# Altium schematic sheet TColourBar.SchDoc: LiveDesign Evaluation - EvalBoard Tester
size A4; Organization: Altium Limited; Address1: L3, 12a Rodborough Rd; Address2: Frenchs Forest; Address3: NSW; Address4: Australia 2086; DocumentNumber: 11; SheetNumber: 11; SheetTotal: 16
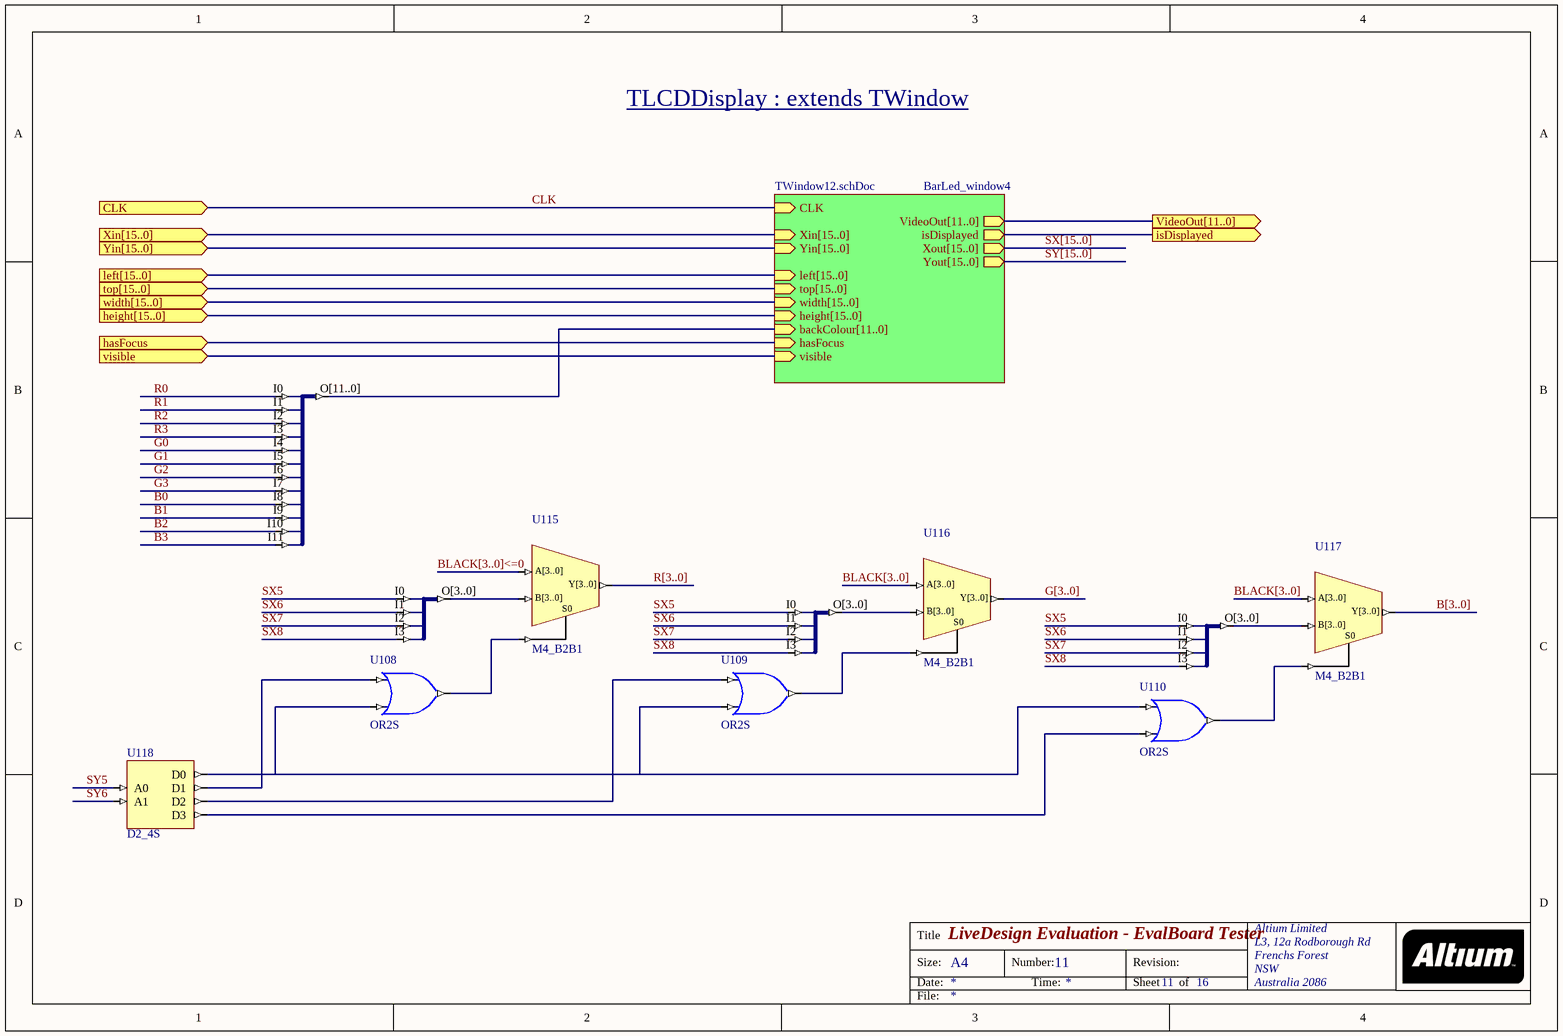
[diagram p0: TColourBar.SchDoc]

## Parts
U108  OR2S
U109  OR2S
U110  OR2S
U111  J4S_4B  (value not drawn)
U112  J4S_4B  (value not drawn)
U113  J4S_4B  (value not drawn)
U114  J12S_12B  (value not drawn)
U115  M4_B2B1
U116  M4_B2B1
U117  M4_B2B1
U118  D2_4S

## Sub-sheets
BarLed_window4 = TWindow12.schDoc: CLK (in), VideoOut[11..0] (out), Xin[15..0] (in), Yin[15..0] (in), top[15..0] (in), width[15..0] (in), height[15..0] (in), left[15..0] (in), Xout[15..0] (out), Yout[15..0] (out), backColour[11..0] (in), isDisplayed (out), visible (in), hasFocus (in)

## Ports
CLK (in), hasFocus (in), height[15..0] (in), isDisplayed (out), left[15..0] (in), top[15..0] (in), VideoOut[11..0] (out), visible (in), width[15..0] (in), Xin[15..0] (in), Yin[15..0] (in)

## Nets
B0: U114.I8
B1: U114.I9
B2: U114.I10
B3: U114.I11
B[3..0]: U117.Y[3..0]
BLACK[3..0]: U116.A[3..0] U117.A[3..0]
BLACK[3..0]<=0: U115.A[3..0]
CLK: port CLK, sheet BarLed_window4/CLK
G0: U114.I4
G1: U114.I5
G2: U114.I6
G3: U114.I7
G[3..0]: U116.Y[3..0]
hasFocus: port hasFocus, sheet BarLed_window4/hasFocus
isDisplayed: port isDisplayed, sheet BarLed_window4/isDisplayed
R0: U114.I0
R1: U114.I1
R2: U114.I2
R3: U114.I3
R[3..0]: U115.Y[3..0]
SX5: U111.I0 U112.I0 U113.I0
SX6: U111.I1 U112.I1 U113.I1
SX7: U111.I2 U112.I2 U113.I2
SX8: U111.I3 U112.I3 U113.I3
SY5: U118.A0
SY6: U118.A1
visible: port visible, sheet BarLed_window4/visible
NetU108_I0: U108.I0 U118.D1
NetU108_I1: U108.I1 U109.I1 U110.I0 U118.D0
NetU108_O: U108.O U115.S0
NetU109_I0: U109.I0 U118.D2
NetU109_O: U109.O U116.S0
NetU110_I1: U110.I1 U118.D3
NetU110_O: U110.O U117.S0
NetU111_O[3..0]: U111.O[3..0] U115.B[3..0]
NetU112_O[3..0]: U112.O[3..0] U116.B[3..0]
NetU113_O[3..0]: U113.O[3..0] U117.B[3..0]
NetU114_O[11..0]: U114.O[11..0] ; sheet BarLed_window4/backColour[11..0]

## Buses and harness runs
bus B[3..0]
bus BLACK[3..0]
bus BLACK[3..0]<=0
bus G[3..0]
bus port height[15..0] = sheet BarLed_window4/height[15..0]
bus port left[15..0] = sheet BarLed_window4/left[15..0]
bus port top[15..0] = sheet BarLed_window4/top[15..0]
bus port VideoOut[11..0] = sheet BarLed_window4/VideoOut[11..0]
bus port width[15..0] = sheet BarLed_window4/width[15..0]
bus port Xin[15..0] = sheet BarLed_window4/Xin[15..0]
bus port Yin[15..0] = sheet BarLed_window4/Yin[15..0]
bus R[3..0]
bus SX[15..0] = sheet BarLed_window4/Xout[15..0]
bus SY[15..0] = sheet BarLed_window4/Yout[15..0]

## Notes on the sheet
- TLCDDisplay : extends TWindow
- Title
- Size:
- Date:
- A4
- Number:
- Time:
- Revision:
- Sheet
- of
- File:

## Library data of the parts
U108-U110 = OR2S: 2-Input OR Gate, Single Pin Version; Xilinx Equivalent: OR2; ArchiveName: GENERIC; VHDLIB_SIM: GENERIC_LIB; Published: 29-Jan-2004; Publisher: Altium Limited; Core Revision: 1.00.00
U111-U113 = J4S_4B: 4 Single pin inputs to single 4-Bit output bus; ArchiveName: GENERIC; VHDLIB_SIM: GENERIC_LIB; Published: 29-Jan-2004; Publisher: Altium Limited; Core Revision: 1.00.00
U114 = J12S_12B: 12 Single pin inputs to single 12-Bit output bus; ArchiveName: GENERIC; VHDLIB_SIM: GENERIC_LIB; Published: 29-Jan-2004; Publisher: Altium Limited; Core Revision: 1.00.00
U115-U117 = M4_B2B1: 2x4-Bit Bus to 1x4-Bit Bus Multiplexer; ArchiveName: GENERIC; VHDLIB_SIM: GENERIC_LIB; Published: 29-Jan-2004; Publisher: Altium Limited; Core Revision: 1.00.00
U118 = D2_4S: Binary 2- to 4-Bit Decoder, Single Pin Version; ArchiveName: GENERIC; VHDLIB_SIM: GENERIC_LIB; Published: 29-Jan-2004; Publisher: Altium Limited; Core Revision: 1.00.00